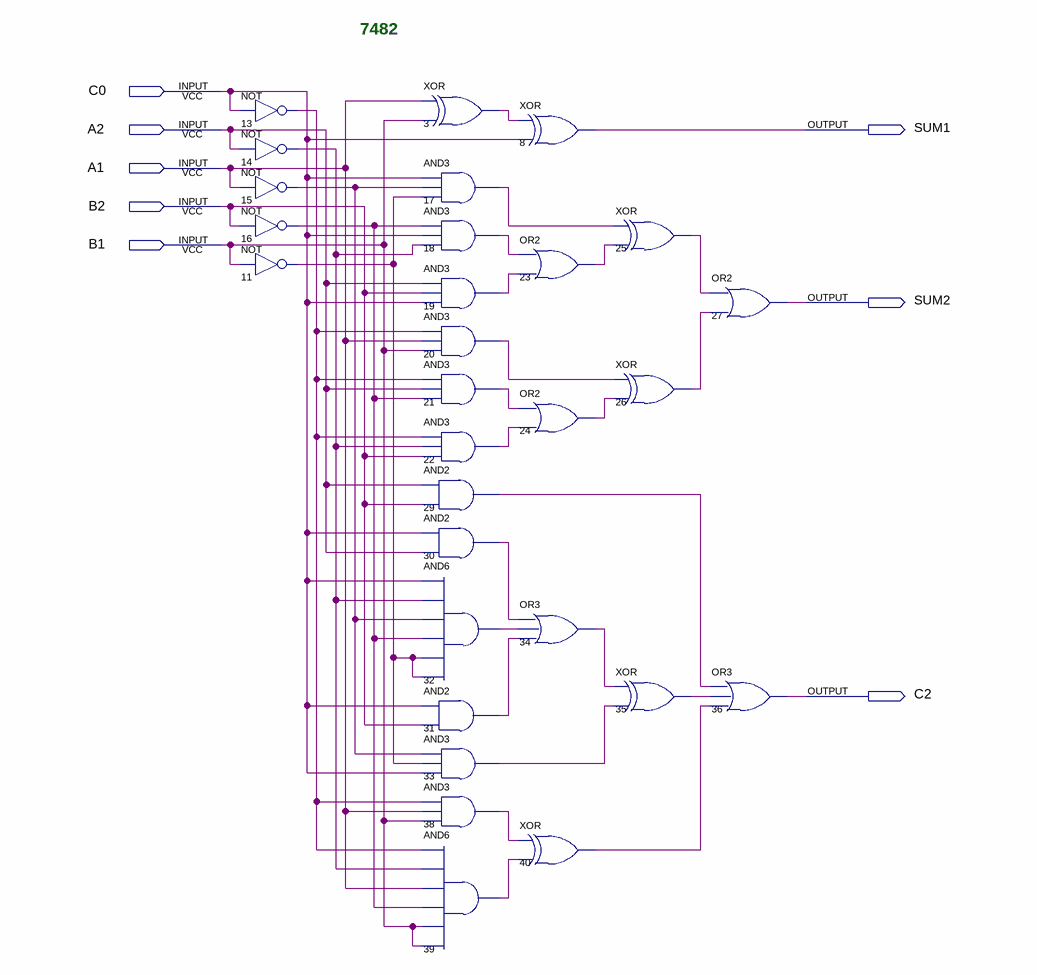
[diagram p0: schematic sheet]
// Quartus schematic 7482.bdf as structural Verilog: 29 symbols, 8 pins
module \7482  (
  input  C0,
  input  A2,
  input  A1,
  input  B2,
  input  B1,
  output SUM1,
  output SUM2,
  output C2
);

  wire n3_out, n11_out, n13_out, n14_out, n15_out, n16_out, n17_out, n18_out, n19_out, n20_out, n21_out,
       n22_out, n23_out, n24_out, n25_out, n26_out, n29_out, n30_out, n31_out, n32_out, n33_out, n34_out,
       n35_out, n38_out, n39_out, n40_out;

  not u_13 (n13_out, C0);
  not u_14 (n14_out, A2);
  not u_15 (n15_out, A1);
  not u_16 (n16_out, B2);
  not u_11 (n11_out, B1);
  xor u_3 (n3_out, A1, B1);
  and u_17 (n17_out, C0, n15_out, n11_out);
  and u_18 (n18_out, n16_out, C0, n14_out);
  and u_19 (n19_out, A2, B2, C0);
  and u_20 (n20_out, n13_out, A1, B1);
  and u_21 (n21_out, n13_out, A2, n16_out);
  and u_22 (n22_out, n13_out, n14_out, B2);
  and u_29 (n29_out, A2, B2);
  and u_30 (n30_out, C0, A2);
  and u_32 (n32_out, C0, n14_out, n15_out, n16_out, n11_out, n11_out);
  and u_31 (n31_out, C0, B2);
  and u_33 (n33_out, n15_out, n11_out, C0);
  and u_38 (n38_out, n13_out, A1, B1);
  and u_39 (n39_out, n13_out, n14_out, A1, n16_out, B1, B1);
  xor u_8 (SUM1, n3_out, C0);
  or u_23 (n23_out, n18_out, n19_out);
  or u_24 (n24_out, n21_out, n22_out);
  or u_34 (n34_out, n30_out, n32_out, n31_out);
  xor u_40 (n40_out, n38_out, n39_out);
  xor u_25 (n25_out, n17_out, n23_out);
  xor u_26 (n26_out, n20_out, n24_out);
  xor u_35 (n35_out, n34_out, n33_out);
  or u_27 (SUM2, n25_out, n26_out);
  or u_36 (C2, n29_out, n35_out, n40_out);

  // Notes on the sheet:
  //   7482
endmodule
